# Altium schematic sheet screen.SchDoc
size A4
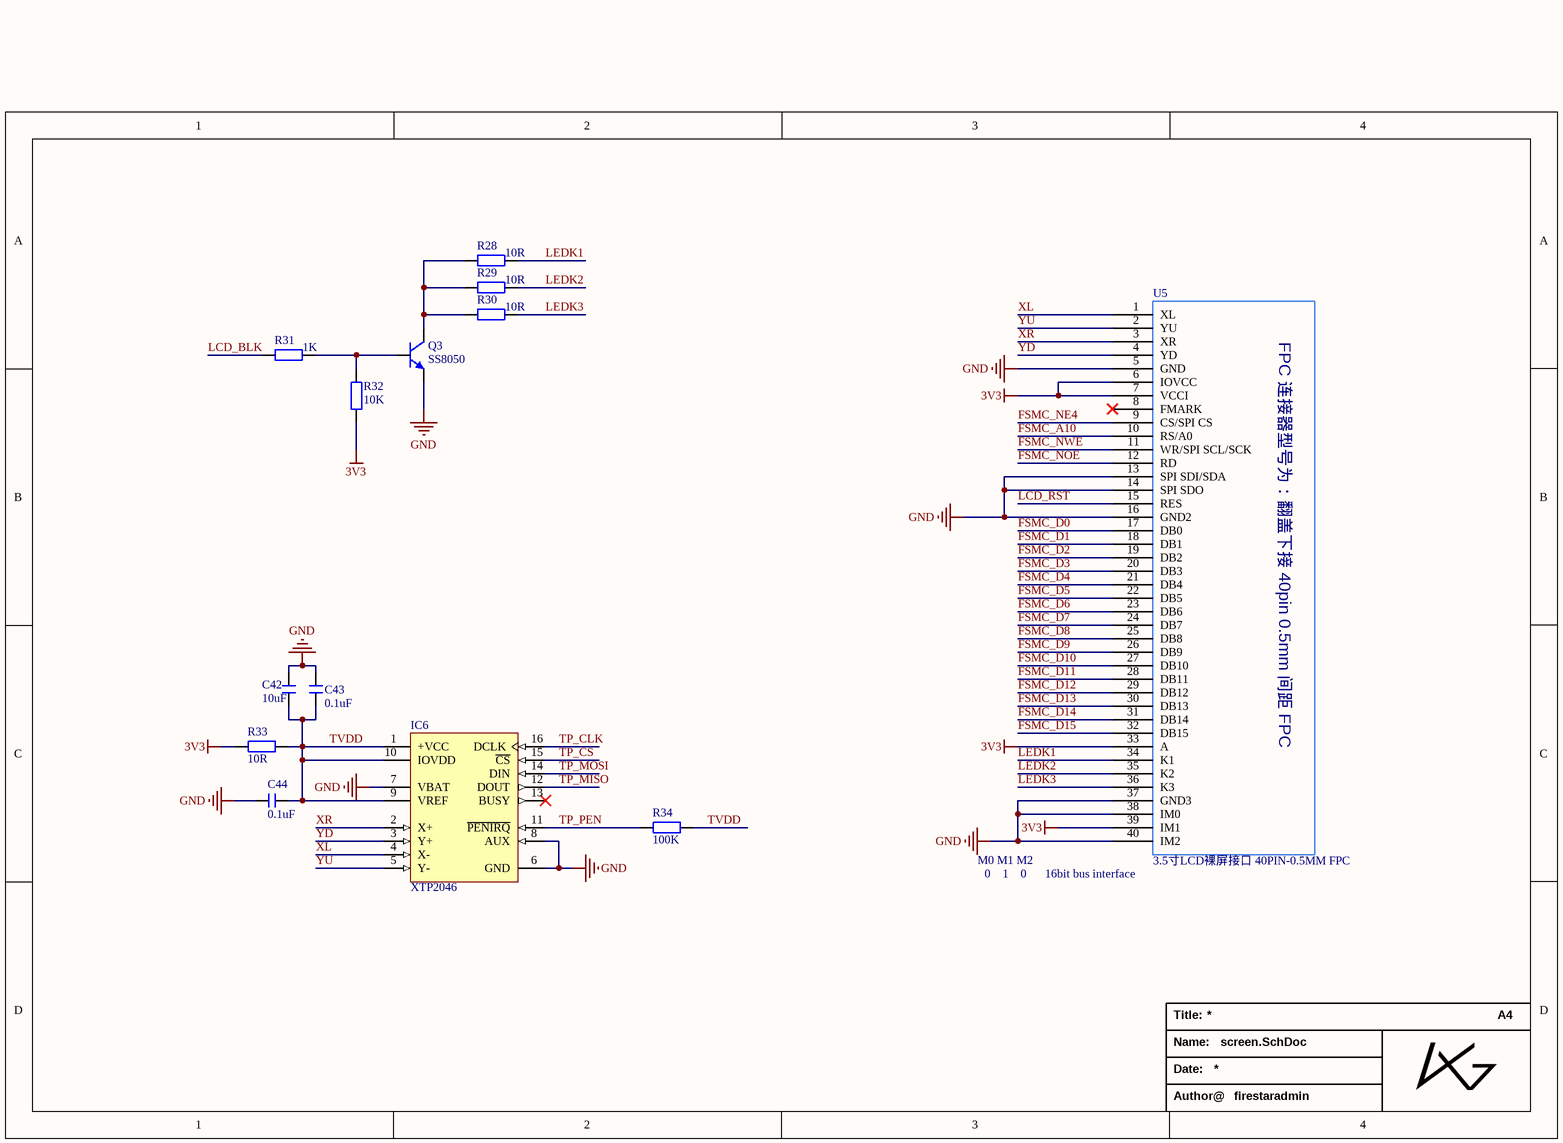
[diagram p0: screen.SchDoc]

## Parts
C42  10uF  [C 0603_M]
C43  0.1uF  [C 0603_M]
C44  0.1uF  [C 0603_M]
IC6  XTP2046  [TSSOP16_M]
Q3  SS8050  [SOT23-3M]
R28  10R  [R 0603_M]
R29  10R  [R 0603_M]
R30  10R  [R 0603_M]
R31  1K  [R 0603_M]
R32  10K  [R 0603_M]
R33  10R  [R 0603_M]
R34  100K  [R 0603_M]
U5  3.5寸LCD裸屏接口 40PIN-0.5MM FPC  [FPC0.5 2H-WS-40P]

## Nets
3V3: R32.1 R33.1 U5.6(IOVCC) U5.7(VCCI) U5.33(A) U5.39(IM1)
GND: C42.1 C43.1 C44.2 IC6.6(GND) IC6.7(VBAT) IC6.8(AUX) Q3.2(E) U5.5(GND) U5.13(SPI_SDI/SDA) U5.14(SPI_SDO) U5.16(GND2) U5.37(GND3) U5.38(IM0) U5.40(IM2)
FSMC_A10: U5.10(RS/A0)
FSMC_D0: U5.17(DB0)
FSMC_D1: U5.18(DB1)
FSMC_D2: U5.19(DB2)
FSMC_D3: U5.20(DB3)
FSMC_D4: U5.21(DB4)
FSMC_D5: U5.22(DB5)
FSMC_D6: U5.23(DB6)
FSMC_D7: U5.24(DB7)
FSMC_D8: U5.25(DB8)
FSMC_D9: U5.26(DB9)
FSMC_D10: U5.27(DB10)
FSMC_D11: U5.28(DB11)
FSMC_D12: U5.29(DB12)
FSMC_D13: U5.30(DB13)
FSMC_D14: U5.31(DB14)
FSMC_D15: U5.32(DB15)
FSMC_NE4: U5.9(CS/SPI_CS)
FSMC_NOE: U5.12(RD)
FSMC_NWE: U5.11(WR/SPI_SCL/SCK)
LCD_BLK: R31.1
LCD_RST: U5.15(RES)
LEDK1: R28.2 U5.34(K1)
LEDK2: R29.2 U5.35(K2)
LEDK3: R30.2 U5.36(K3)
TP_CLK: IC6.16(DCLK)
TP_CS: IC6.15(~{CS})
TP_MISO: IC6.12(DOUT)
TP_MOSI: IC6.14(DIN)
TP_PEN: IC6.11(~{PENIRQ}) R34.1
TVDD: C42.2 C43.2 C44.1 IC6.1(+VCC) IC6.9(VREF) IC6.10(IOVDD) R33.2 R34.2
XL: IC6.4(X-) U5.1(XL)
XR: IC6.2(X+) U5.3(XR)
YD: IC6.3(Y+) U5.4(YD)
YU: IC6.5(Y-) U5.2(YU)
NetQ3_1: Q3.1(B) R31.2 R32.2
NetQ3_3: Q3.3(C) R28.1 R29.1 R30.1

Not connected (* = marked no-connect by the designer): IC6 13(BUSY)*; U5 8(FMARK)*

## Notes on the sheet
- M0 M1 M2
- 0    1    0
- (near U5) 16bit bus interface
- Title:
- A4
- Name:
- Date:
- Author@
- firestaradmin
- (in symbol 3.5寸LCD裸屏接口 40PIN-0.5MM FPC) FPC 连接器型号为：翻盖下接 40pin 0.5mm 间距 FPC

## Library data of the parts
C42-C44 = C: 无极性贴片电容; 版权归属: 源创客; BOM名称: 无极性贴片电容; 学习资源: www.ooocke.com
IC6 = TSC2046IPW: 显示屏触摸驱动芯片; BOM名称: 触摸驱动芯片; 版权归属: 源创客; 学习资源: www.ooocke.com
Q3 = 8050-SMD: 高频放大-NPN型; 版权归属: 源创客; 属性: 40V 1.5A 1W 100MHZ; BOM名称: 高频放大-NPN型; 学习资源: www.ooocke.com
R28-R34 = R: 贴片电阻; 版权归属: 源创客; BOM名称: 贴片电阻; 学习资源: www.ooocke.com
U5 = 3.5寸LCD裸屏接口 40PIN-0.5MM FPC: 3.5寸LCD屏幕 40PIN-0.5MM FPC 接口